# EAGLE schematic ADS8588S (EAGLE 9.5.2)
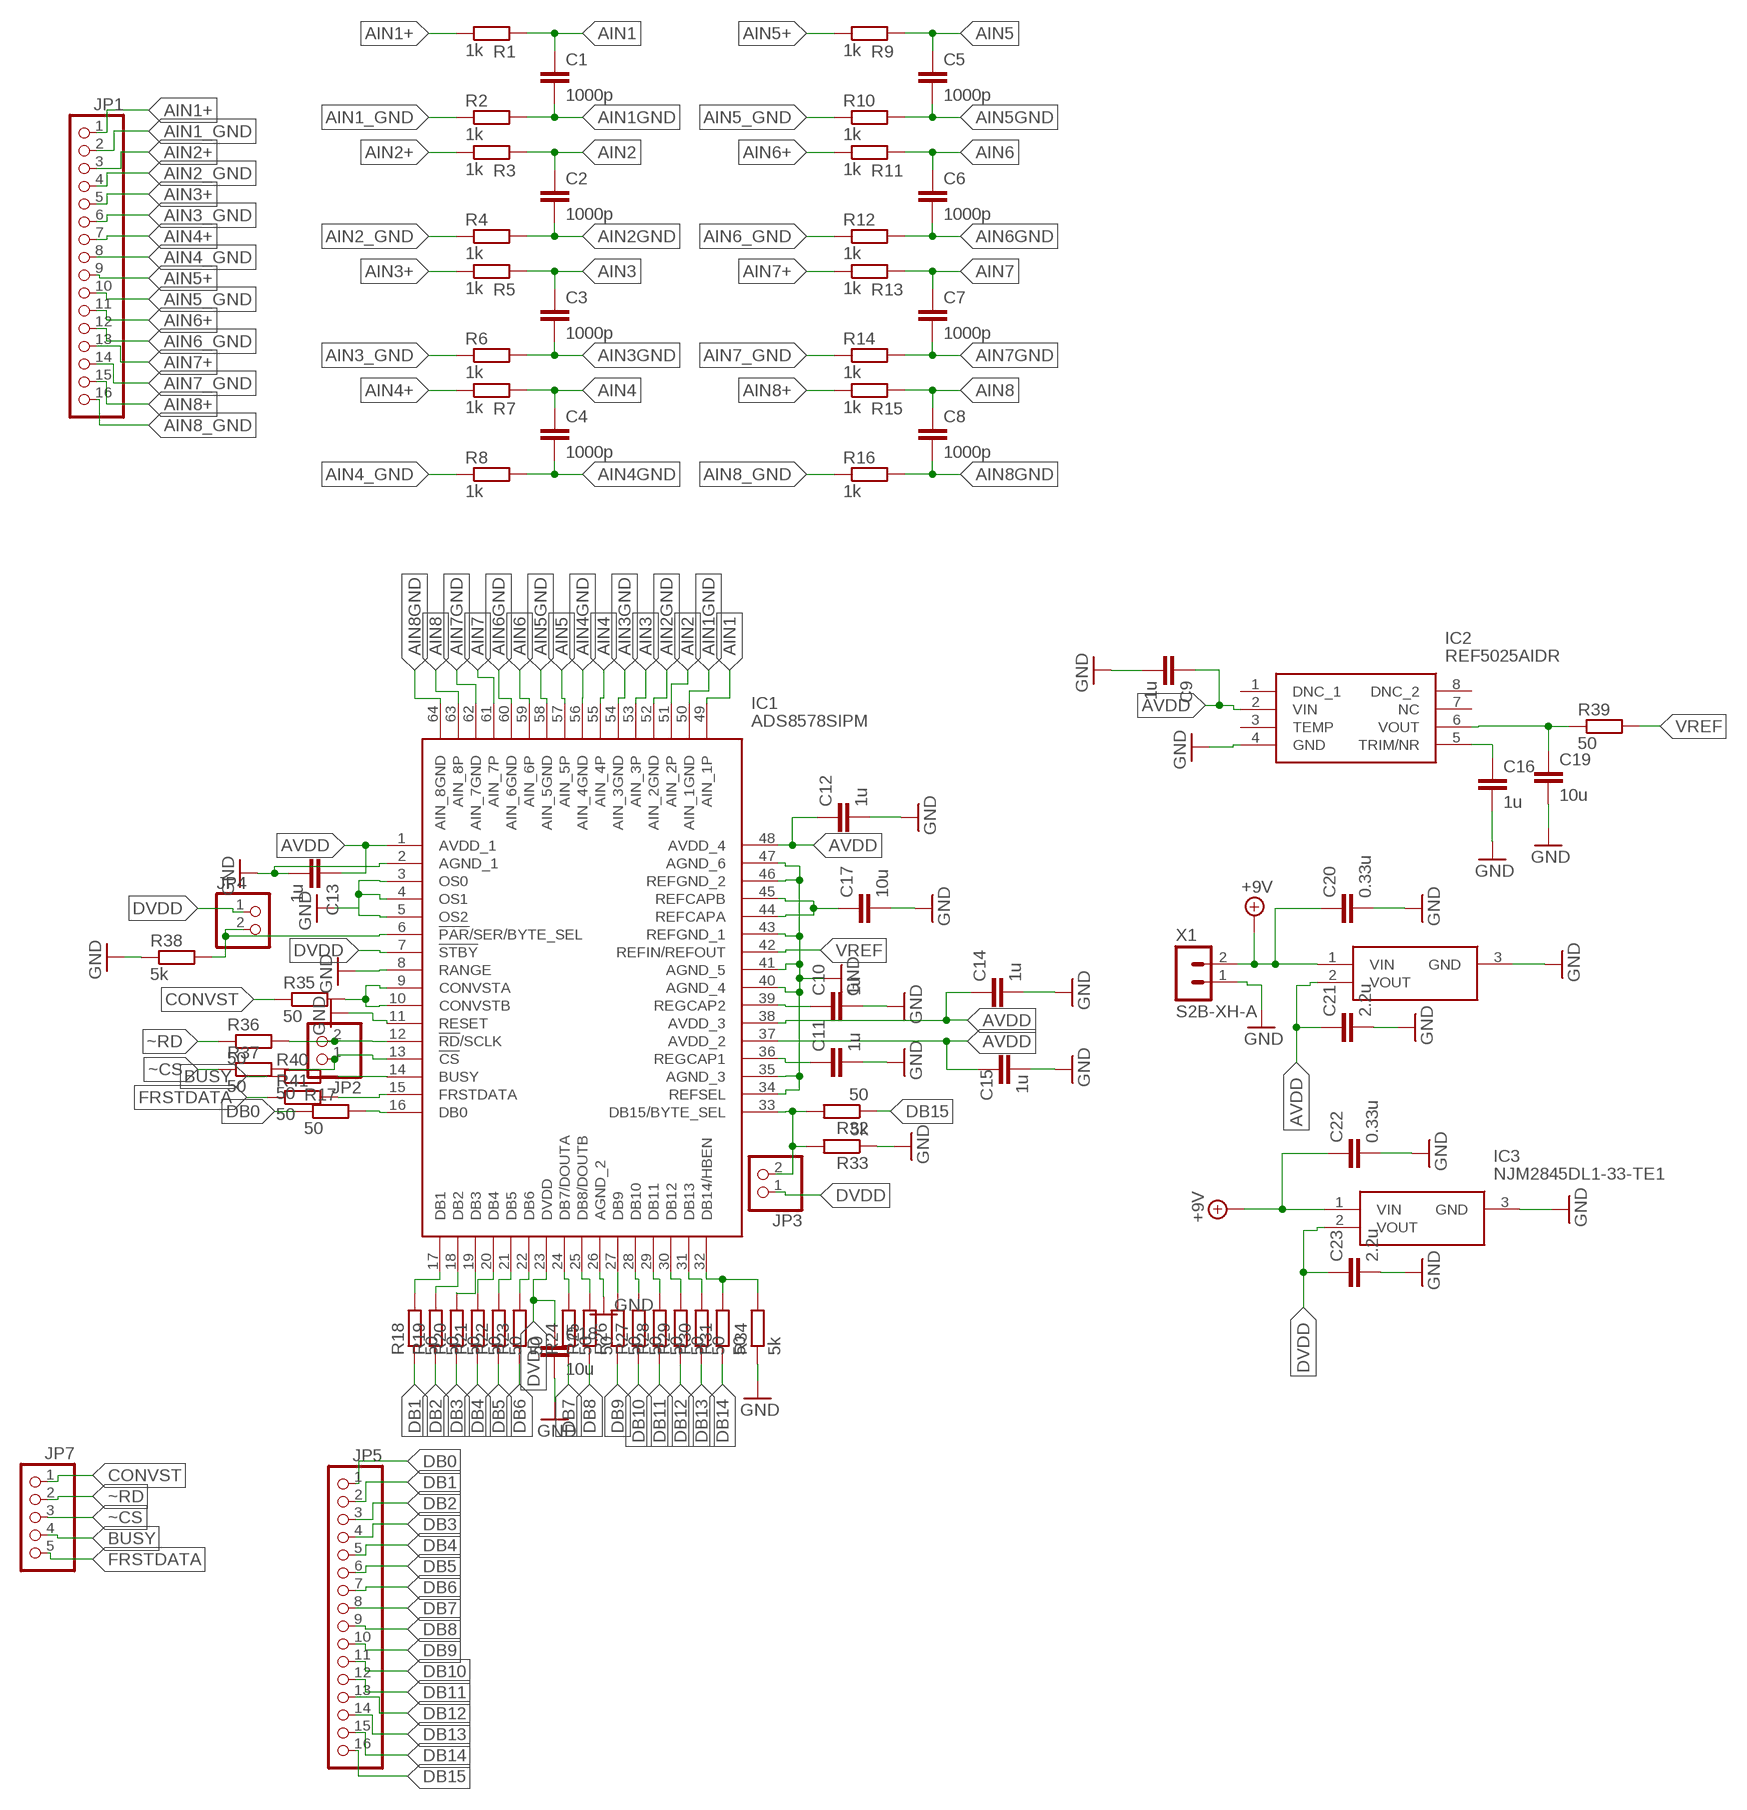
[diagram p0: schematic, sheet 1]

## Parts
C1  1000p  C-EUC0603K  [C0603K]
C2  1000p  C-EUC0603K  [C0603K]
C3  1000p  C-EUC0603K  [C0603K]
C4  1000p  C-EUC0603K  [C0603K]
C5  1000p  C-EUC0603K  [C0603K]
C6  1000p  C-EUC0603K  [C0603K]
C7  1000p  C-EUC0603K  [C0603K]
C8  1000p  C-EUC0603K  [C0603K]
C9  1u  C-EUC0603K  [C0603K]
C10  1u  C-EUC0603K  [C0603K]
C11  1u  C-EUC0603K  [C0603K]
C12  1u  C-EUC0603K  [C0603K]
C13  1u  C-EUC0603K  [C0603K]
C14  1u  C-EUC0603K  [C0603K]
C15  1u  C-EUC0603K  [C0603K]
C16  1u  C-EUC0603K  [C0603K]
C17  10u  C-EUC0805K  [C0805K]
C18  10u  C-EUC0805K  [C0805K]
C19  10u  C-EUC0805K  [C0805K]
C20  0.33u  C-EUC0603K  [C0603K]
C21  2.2u  C-EUC0805K  [C0805K]
C22  0.33u  C-EUC0603K  [C0603K]
C23  2.2u  C-EUC0805K  [C0805K]
IC1  ADS8578SIPM  [QFP50P1200X1200X160-64N]
IC2  REF5025AIDR  [SOIC127P600X175-8N]
IC3  NJM2845DL1-33-TE1  [TO-252-3-L1]
IC5  NJM2845DL1-05-TE1  [TO-252-3-L1]
JP1  PINHD-1X16  [1X16]
JP2  PINHD-1X2  [1X02]
JP3  PINHD-1X2  [1X02]
JP4  PINHD-1X2  [1X02]
JP5  PINHD-1X16  [1X16]
JP7  PINHD-1X5  [1X05]
R1  1k  R-EU_R0603  [R0603]
R2  1k  R-EU_R0603  [R0603]
R3  1k  R-EU_R0603  [R0603]
R4  1k  R-EU_R0603  [R0603]
R5  1k  R-EU_R0603  [R0603]
R6  1k  R-EU_R0603  [R0603]
R7  1k  R-EU_R0603  [R0603]
R8  1k  R-EU_R0603  [R0603]
R9  1k  R-EU_R0603  [R0603]
R10  1k  R-EU_R0603  [R0603]
R11  1k  R-EU_R0603  [R0603]
R12  1k  R-EU_R0603  [R0603]
R13  1k  R-EU_R0603  [R0603]
R14  1k  R-EU_R0603  [R0603]
R15  1k  R-EU_R0603  [R0603]
R16  1k  R-EU_R0603  [R0603]
R17  50  R-EU_R0603  [R0603]
R18  50  R-EU_R0603  [R0603]
R19  50  R-EU_R0603  [R0603]
R20  50  R-EU_R0603  [R0603]
R21  50  R-EU_R0603  [R0603]
R22  50  R-EU_R0603  [R0603]
R23  50  R-EU_R0603  [R0603]
R24  50  R-EU_R0603  [R0603]
R25  50  R-EU_R0603  [R0603]
R26  50  R-EU_R0603  [R0603]
R27  50  R-EU_R0603  [R0603]
R28  50  R-EU_R0603  [R0603]
R29  50  R-EU_R0603  [R0603]
R30  50  R-EU_R0603  [R0603]
R31  50  R-EU_R0603  [R0603]
R32  50  R-EU_R0603  [R0603]
R33  5k  R-EU_R0603  [R0603]
R34  5k  R-EU_R0603  [R0603]
R35  50  R-EU_R0603  [R0603]
R36  50  R-EU_R0603  [R0603]
R37  50  R-EU_R0603  [R0603]
R38  5k  R-EU_R0603  [R0603]
R39  50  R-EU_R0603  [R0603]
R40  50  R-EU_R0603  [R0603]
R41  50  R-EU_R0603  [R0603]
X1  S2B-XH-A  [S2B-XH-A]

## Nets
+9V: C20.1 C22.1 IC3.1(VIN) IC5.1(VIN) X1.2
AIN1: C1.1 IC1.49(AIN_1P) R1.2
AIN1+: JP1.1 R1.1
AIN1_GND: JP1.2 R2.1
AIN1GND: C1.2 IC1.50(AIN_1GND) R2.2
AIN2: C2.1 IC1.51(AIN_2P) R3.2
AIN2+: JP1.3 R3.1
AIN2_GND: JP1.4 R4.1
AIN2GND: C2.2 IC1.52(AIN_2GND) R4.2
AIN3: C3.1 IC1.53(AIN_3P) R5.2
AIN3+: JP1.5 R5.1
AIN3_GND: JP1.6 R6.1
AIN3GND: C3.2 IC1.54(AIN_3GND) R6.2
AIN4: C4.1 IC1.55(AIN_4P) R7.2
AIN4+: JP1.7 R7.1
AIN4_GND: JP1.8 R8.1
AIN4GND: C4.2 IC1.56(AIN_4GND) R8.2
AIN5: C5.1 IC1.57(AIN_5P) R9.2
AIN5+: JP1.9 R9.1
AIN5_GND: JP1.10 R10.1
AIN5GND: C5.2 IC1.58(AIN_5GND) R10.2
AIN6: C6.1 IC1.59(AIN_6P) R11.2
AIN6+: JP1.11 R11.1
AIN6_GND: JP1.12 R12.1
AIN6GND: C6.2 IC1.60(AIN_6GND) R12.2
AIN7: C7.1 IC1.61(AIN_7P) R13.2
AIN7+: JP1.13 R13.1
AIN7_GND: JP1.14 R14.1
AIN7GND: C7.2 IC1.62(AIN_7GND) R14.2
AIN8: C8.1 IC1.63(AIN_8P) R15.2
AIN8+: JP1.15 R15.1
AIN8_GND: JP1.16 R16.1
AIN8GND: C8.2 IC1.64(AIN_8GND) R16.2
AVDD: C9.1 C12.1 C13.1 C14.1 C15.1 C21.1 IC1.1(AVDD_1) IC1.37(AVDD_2) IC1.38(AVDD_3) IC1.48(AVDD_4) IC2.2(VIN) IC5.2(VOUT)
BUSY: JP7.4 R40.1
CONVST: JP7.1 R35.1
DB0: JP5.1 R17.1
DB1: JP5.2 R18.1
DB2: JP5.3 R19.1
DB3: JP5.4 R20.1
DB4: JP5.5 R21.1
DB5: JP5.6 R22.1
DB6: JP5.7 R23.1
DB7: JP5.8 R24.1
DB8: JP5.9 R25.1
DB9: JP5.10 R26.1
DB10: JP5.11 R27.1
DB11: JP5.12 R28.1
DB12: JP5.13 R29.1
DB13: JP5.14 R30.1
DB14: JP5.15 R31.1
DB15: JP5.16 R32.1
DVDD: C18.1 C23.1 IC1.7(!STBY) IC1.23(DVDD) IC3.2(VOUT) JP3.1 JP4.1
DVDD1: C19.1 IC2.6(VOUT) R39.1
FRSTDATA: JP7.5 R41.1
GND: C9.2 C10.2 C11.2 C12.2 C13.2 C14.2 C15.2 C16.2 C17.2 C18.2 C19.2 C20.2 C21.2 C22.2 C23.2 IC1.2(AGND_1) IC1.3(OS0) IC1.4(OS1) IC1.5(OS2) IC1.8(RANGE) IC1.11(RESET) IC1.26(AGND_2) IC1.34(REFSEL) IC1.35(AGND_3) IC1.40(AGND_4) IC1.41(AGND_5) IC1.43(REFGND_1) IC1.46(REFGND_2) IC1.47(AGND_6) IC2.4(GND) IC3.3(GND) IC5.3(GND) R33.1 R34.1 R38.1 X1.1
N$1: C17.1 IC1.44(REFCAPA) IC1.45(REFCAPB)
N$2: IC1.9(CONVSTA) IC1.10(CONVSTB) R35.2
N$3: C10.1 IC1.39(REGCAP2)
N$4: C11.1 IC1.36(REGCAP1)
N$5: IC1.17(DB1) R18.2
N$6: IC1.18(DB2) R19.2
N$7: IC1.19(DB3) R20.2
N$8: IC1.20(DB4) R21.2
N$9: IC1.21(DB5) R22.2
N$10: IC1.22(DB6) R23.2
N$11: IC1.24(DB7/DOUTA) R24.2
N$12: IC1.25(DB8/DOUTB) R25.2
N$13: IC1.27(DB9) R26.2
N$14: IC1.28(DB10) R27.2
N$15: IC1.29(DB11) R28.2
N$16: IC1.30(DB12) R29.2
N$17: IC1.31(DB13) R30.2
N$18: IC1.32(DB14/HBEN) R31.2 R34.2
N$19: IC1.33(DB15/BYTE_SEL) JP3.2 R32.2 R33.2
N$20: IC1.16(DB0) R17.2
N$21: IC1.6(!PAR!/SER/BYTE_SEL) JP4.2 R38.2
N$22: C16.1 IC2.5(TRIM/NR)
N$23: IC1.12(!RD!/SCLK) JP2.2 R36.2
N$24: IC1.13(!CS) JP2.1 R37.2
N$25: IC1.15(FRSTDATA) R41.2
N$26: IC1.14(BUSY) R40.2
VREF: IC1.42(REFIN/REFOUT) R39.2
~CS: JP7.3 R37.1
~RD: JP7.2 R36.1
Unconnected: IC2.1(DNC_1) IC2.3(TEMP) IC2.7(NC) IC2.8(DNC_2)

## Library data of the parts
C1-C23 = rcl:C-EU: CAPACITOR, European symbol; SPICEPREFIX: C
IC1 = SamacSys_Parts:ADS8578SIPM: 14-Bit High-Speed 8-Channel Simultaneous-Sampling ADC With Bipolar Inputs on a Single Supply Source: Datasheet <http://www.ti.com/lit/gpn/ADS8578S>; DESCRIPTION: 14-Bit High-Speed 8-Channel Simultaneous-Sampling ADC With Bipolar Inputs on a Single Supply; HEIGHT: 1.6mm; MANUFACTURER_NAME: Texas Instruments; MANUFACTURER_PART_NUMBER: ADS8578SIPM; MOUSER_PART_NUMBER: 595-ADS8578SIPM; MOUSER_PRICE-STOCK: https://www.mouser.co.uk/ProductDetail/Texas-Instruments/ADS8578SIPM?qs=5aG0NVq1C4wnC0s0XWUMqw%3D%3D
IC2 = SamacSys_Parts:REF5025AIDR: 3 Vpp/V Noise, 3 ppm/C Drift Precision Series Voltage Reference Source: Datasheet <http://www.ti.com/lit/gpn/ref5025>; DESCRIPTION: 3 Vpp/V Noise, 3 ppm/C Drift Precision Series Voltage Reference; HEIGHT: 1.75mm; MANUFACTURER_NAME: Texas Instruments; MANUFACTURER_PART_NUMBER: REF5025AIDR; MOUSER_PART_NUMBER: 595-REF5025AIDR; MOUSER_PRICE-STOCK: https://www.mouser.co.uk/ProductDetail/Texas-Instruments/REF5025AIDR?qs=xL7PkI2RoJ70M4JvRcjI4A%3D%3D
IC3 = SamacSys_Parts:NJM2845DL1-33-TE1: LDO Voltage Regulators LDO w/On/Off Cntrl Source: Datasheet <http://www.njr.com/semicon/PDF/NJM2845_NJM2846_E.pdf>; DESCRIPTION: LDO Voltage Regulators LDO w/On/Off Cntrl; HEIGHT: mm; MANUFACTURER_NAME: New Japan Radio; MANUFACTURER_PART_NUMBER: NJM2845DL1-33-TE1; MOUSER_PART_NUMBER: 513-NJM2845DL133-TE1; MOUSER_PRICE-STOCK: https://www.mouser.co.uk/ProductDetail/NJR/NJM2845DL1-33-TE1/?qs=Vf9KeiGtj%252BHsxdmME1E7bA%3D%3D
IC5 = SamacSys_Parts:NJM2845DL1-05-TE1: LDO Voltage Regulators LDO w/On/Off Cntrl Source: Datasheet <http://www.njr.com/semicon/PDF/NJM2845_NJM2846_E.pdf>; DESCRIPTION: LDO Voltage Regulators LDO w/On/Off Cntrl; HEIGHT: mm; MANUFACTURER_NAME: New Japan Radio; MANUFACTURER_PART_NUMBER: NJM2845DL1-05-TE1; MOUSER_PART_NUMBER: 513-NJM2845DL105-TE1; MOUSER_PRICE-STOCK: https://www.mouser.co.uk/ProductDetail/NJR/NJM2845DL1-05-TE1/?qs=Vf9KeiGtj%252BGbfCGSGlajaA%3D%3D
JP1 JP5 = pinhead:PINHD-1X16: PIN HEADER
JP2-JP4 = pinhead:PINHD-1X2: PIN HEADER
JP7 = pinhead:PINHD-1X5: PIN HEADER
R1-R41 = rcl:R-EU_: RESISTOR, European symbol; SPICEPREFIX: R
X1 = con-JST XH:S2B-XH: JST XH series header 2.50mm pitch disconnectable crimp style connectors, horizontal (side entry type), 2 pins